# EAGLE design LED_Display_4dig (EAGLE 6.4)
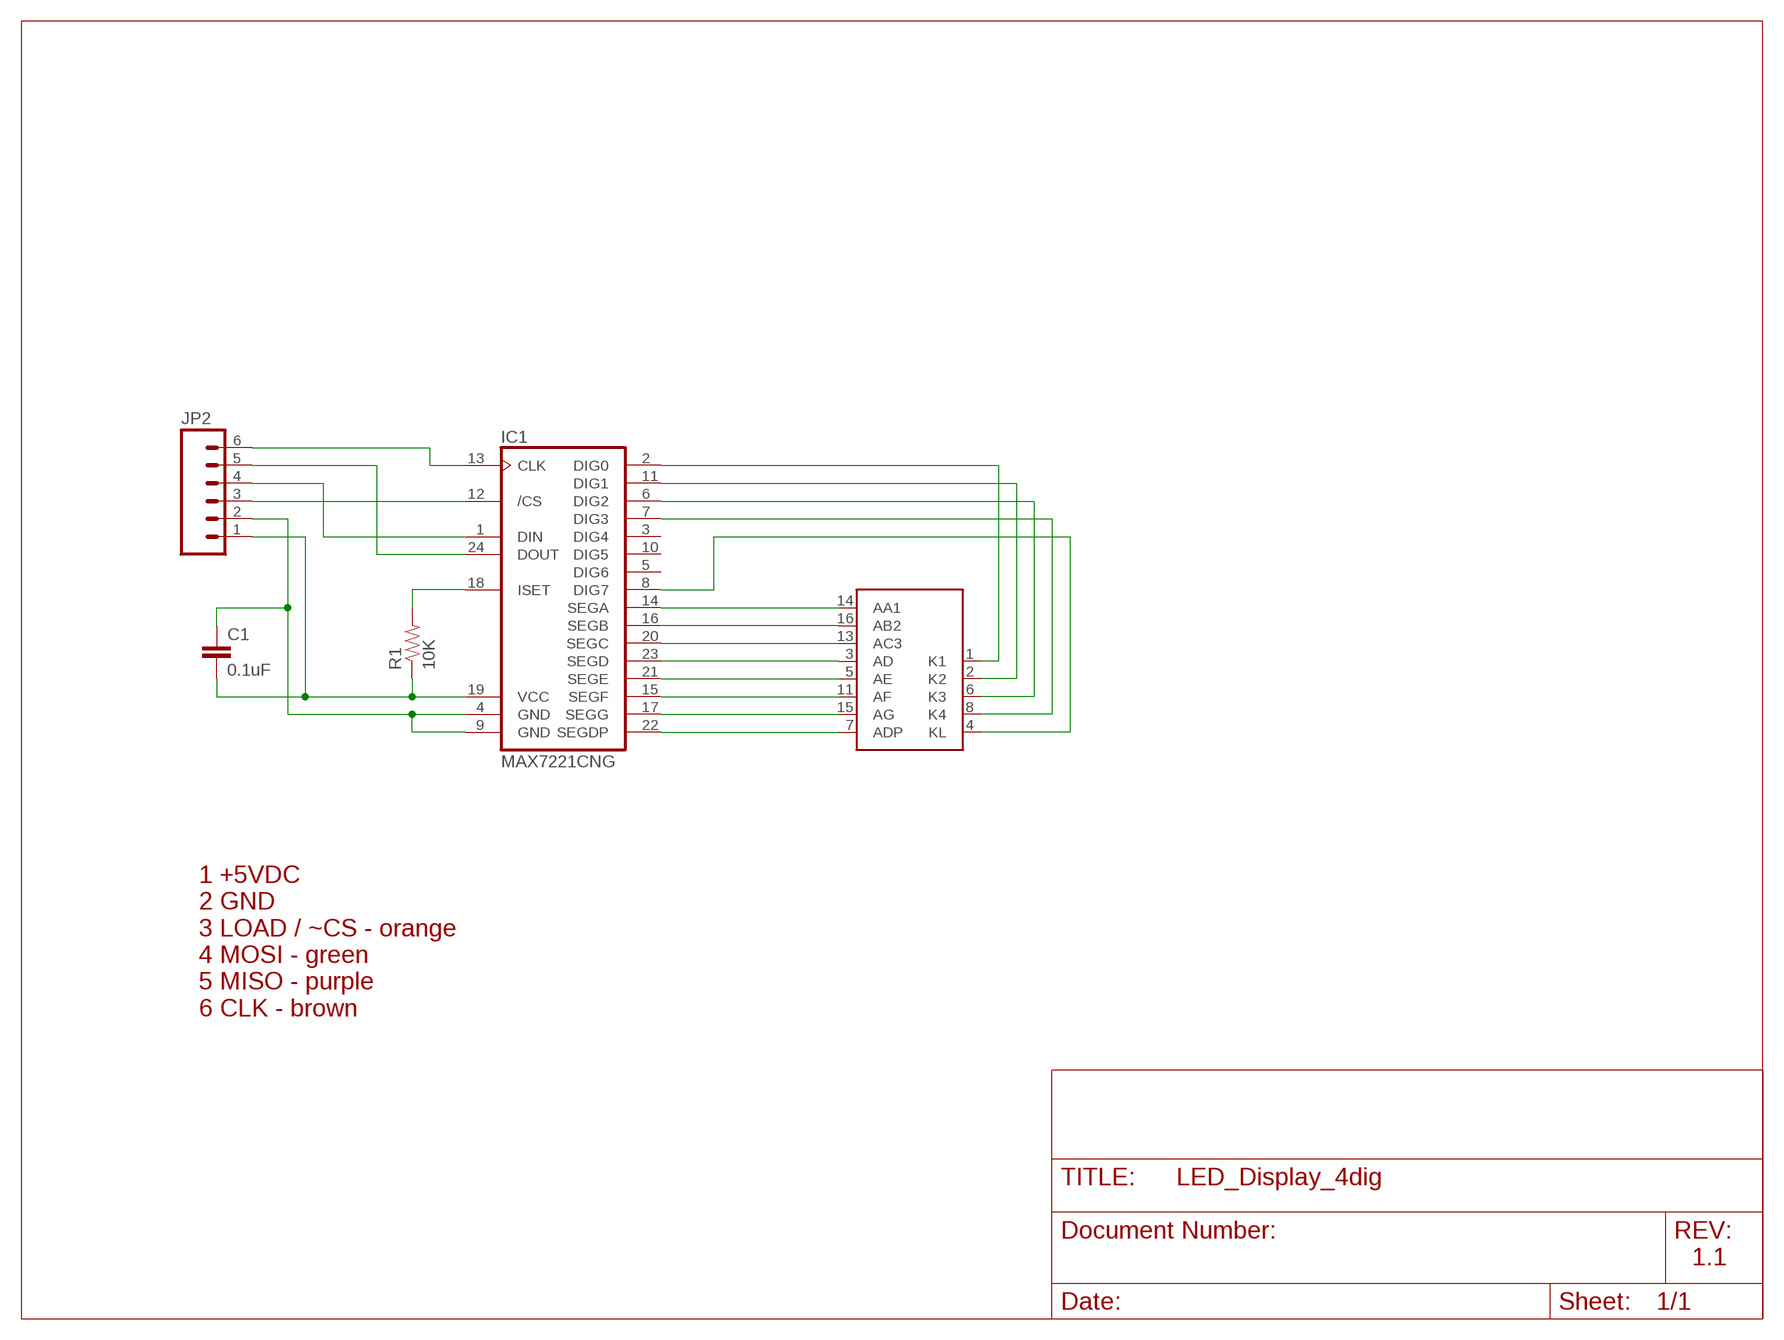
[diagram p0: schematic, sheet 1]

## Parts
C1  0.1uF  CAPPTH  [CAP-PTH-SMALL]
IC1  MAX7221CNG  [DIL24-3]
JP2  M06LOCK_LONGPADS  [1X06_LOCK_LONGPADS]
R1  10K  RESISTORPTH-1/4W  [AXIAL-0.4]
U$1  LTC-4027JRLTC-4027JR  [LTC-4727JR]

## Nets
+5VDC [POWER]: C1.2 IC1.19(VCC) JP2.1 R1.P$1
GND [POWER]: C1.1 IC1.4(GND) IC1.9(GND) JP2.2
N$4: IC1.12(/CS) JP2.3
N$5: IC1.1(DIN) JP2.4
N$6: IC1.24(DOUT) JP2.5
N$7: IC1.13(CLK) JP2.6
N$8: IC1.2(DIG0) U$1.1(K1)
N$9: IC1.11(DIG1) U$1.2(K2)
N$10: IC1.6(DIG2) U$1.6(K3)
N$11: IC1.7(DIG3) U$1.8(K4)
N$12: IC1.8(DIG7) U$1.4(KL)
N$13: IC1.14(SEGA) U$1.14(AA1)
N$14: IC1.16(SEGB) U$1.16(AB2)
N$15: IC1.20(SEGC) U$1.13(AC3)
N$16: IC1.23(SEGD) U$1.3(AD)
N$17: IC1.21(SEGE) U$1.5(AE)
N$18: IC1.15(SEGF) U$1.11(AF)
N$19: IC1.17(SEGG) U$1.15(AG)
N$20: IC1.22(SEGDP) U$1.7(ADP)
N$21: IC1.18(ISET) R1.P$2
Unconnected: IC1.3(DIG4) IC1.5(DIG6) IC1.10(DIG5)

## Notes on the sheet
- 1 +5VDC
  2 GND
  3 LOAD / ~CS - orange
  4 MOSI - green
  5 MISO - purple
  6 CLK - brown
- 1.1

## Library data of the parts
C1 = SparkFun-Capacitors:CAP: Capacitor Standard 0603 ceramic capacitor, and 0.1" leaded capacitor.
IC1 = maxim-6a:MAX7221*: Serially Interfaced, 8-Digit LED Display Drivers
JP2 = SparkFun-Connectors:M06: Header 6 Standard 6-pin 0.1" header. Use with straight break away headers (SKU : PRT-00116), right angle break away headers (PRT-00553), swiss pins (PRT-00743), machine pins (PRT-00117), and female headers (PRT-00115). Molex polarized connector foot print use with SKU : PRT-08094 with associated crimp pins and housings. NOTES ON THE VARIANTS LOCK and LOCK_LONGPADS... This footprint was designed to help hold the alignment of a through-hole component (i.e. 6-pin header) while soldering it into place. You may notice that each hole has been shifted either up or down by 0.005 of an inch from it's more standard position (which is a perfectly straight line). This slight alteration caused the pins (the squares in the middle) to touch the edges of the holes. Because they are alternating, it causes a "brace" to hold the component in place. 0.005 has proven to be the perfect amount of "off-center" position when using our standard breakaway headers. Although looks a little odd when you look at the bare footprint, once you have a header in there, the alteration is very hard to notice. Also, if you push a header all the way into place, it is covered up entirely on the bottom side. This idea of altering the position of holes to aid alignment will be further integrated into the Sparkfun Library for other footprints. It can help hold any component with 3 or more connection pins.
R1 = SparkFun-Passives:RESISTOR: Resistor Basic schematic elements and footprints for 0603, 1206, and PTH resistors.
U$1 = LTC-4727JR:LTC-4027JR

## Net classes
1 POWER: width 0.61 mm

## Board
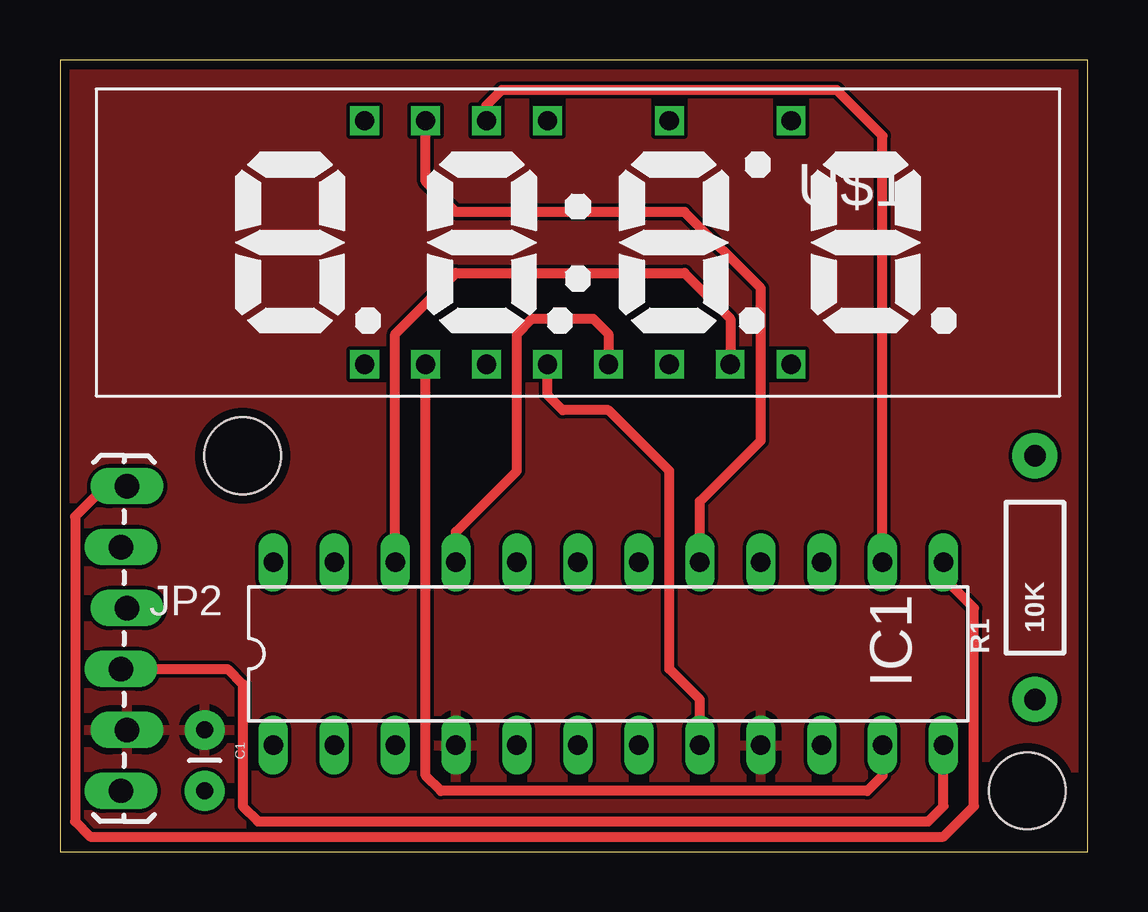
[diagram p1: board, top side]
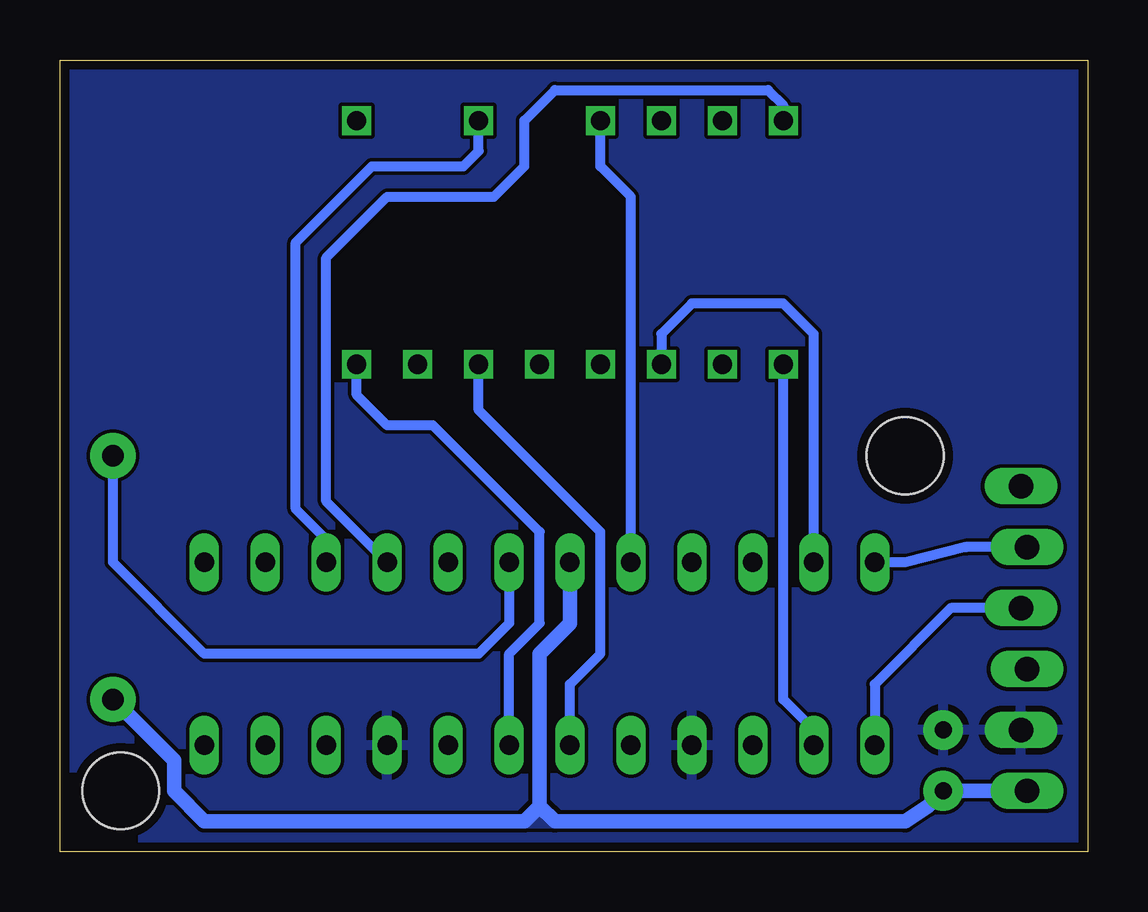
[diagram p2: board, bottom side, seen from below]

Size 42.85 x 33.01 mm. Coordinates in mm from the lower left corner, seen from the top.
Outline: 0,0 42.85,0 42.85,33.01 0,33.01 0,0
Copper layers (1*16): Top 0.0356mm / dielectric 1.5011mm / Bottom 0.0356mm
Design rules "LaenPCBOrder": minimum track width 6mil, minimum drill 13mil, track to track 6mil, track to pad 6mil, pad to pad 6mil, via to via 6mil, smd to smd 6mil, copper to edge 15mil, drill to drill 6mil, minimum pad ring 7mil, minimum via ring 7mil, stop-mask expansion 4mil, vias tented up to drill 0mil, thermal gap 10mil
Holes 3.2 mm at 7.62,16.51 40.32,2.54

### Footprints (pad centres in the part's own frame; a part is rotated, then mirrored left to right if it is on the bottom)
CAP-PTH-SMALL = drill 0.7 pad 1.651: 1 0,0; 2 2.54,0
DIL24-3 = drill 0.813 long: 1 -13.97,-3.81; 2 -11.43,-3.81; 3 -8.89,-3.81; 4 -6.35,-3.81; 5 -3.81,-3.81; 6 -1.27,-3.81; 7 1.27,-3.81; 8 3.81,-3.81; 9 6.35,-3.81; 10 8.89,-3.81; 11 11.43,-3.81; 12 13.97,-3.81; 13 13.97,3.81; 14 11.43,3.81; 15 8.89,3.81; 16 6.35,3.81; 17 3.81,3.81; 18 1.27,3.81; 19 -1.27,3.81; 20 -3.81,3.81; 21 -6.35,3.81; 22 -8.89,3.81; 23 -11.43,3.81; 24 -13.97,3.81
1X06_LOCK_LONGPADS = drill 1.016 long: 1 0,0; 2 2.54,-0.254; 3 5.08,0; 4 7.62,-0.254; 5 10.16,0; 6 12.7,-0.254
AXIAL-0.4 = drill 0.9 pad 1.88: P$1 -5.08,0; P$2 5.08,0
LTC-4727JR = drill 0.8 square: 1 -8.89,-5.08; 2 -6.35,-5.08; 3 -3.81,-5.08; 4 -1.27,-5.08; 5 1.27,-5.08; 6 3.81,-5.08; 7 6.35,-5.08; 8 8.89,-5.08; 9 8.89,5.08; 11 3.81,5.08; 13 -1.27,5.08; 14 -3.81,5.08; 15 -6.35,5.08; 16 -8.89,5.08

### Placement (x,y rotation side)
C1  6.03,5.08 270 top
IC1  22.86,8.26 0 top
JP2  2.54,2.54 90 top
R1  40.64,11.43 90 top
U$1  21.59,25.4 0 top

### Tracks (layer width: path | path; a pad name or v marks a point on that pad's centre or on a via)
+5VDC
  Bottom 0.61: JP2.1 C1.2 6.67,1.91 7.62,1.27 22.23,1.27 22.86,1.91 | 22.86,1.91 22.86,8.26 21.59,9.53 IC1.19 | R1.P$1 38.1,3.81 38.1,2.54 36.83,1.27 23.5,1.27 22.86,1.91
  pour Bottom: 22.86,1.91 22.23,1.27 23.5,1.27
GND
  pour Bottom (rank 3): 0,0 0,33.02 43.18,33.02 43.18,0
  pour Top: 0,0 0,33.02 43.18,33.02 43.18,0
N$4
  Top 0.406: JP2.3 6.99,7.62 7.62,6.99 7.62,1.91 8.26,1.27 36.2,1.27 36.83,1.91 IC1.12
N$5
  Bottom 0.406: JP2.4 5.71,10.16 8.89,6.99 IC1.1
N$6
  Bottom 0.406: JP2.5 5.08,12.7 7.62,12.06 IC1.24
N$7
  Top 0.406: JP2.6 1.91,15.24 0.64,13.97 0.64,1.27 1.27,0.64 36.83,0.64 38.1,1.91 38.1,10.16 36.83,11.43 IC1.13
N$8
  Bottom 0.406: IC1.2 11.43,5.08 12.7,6.35 U$1.1
N$9
  Top 0.406: IC1.11 34.29,3.17 33.66,2.54 15.88,2.54 15.24,3.17 U$1.2
N$10
  Bottom 0.406: IC1.6 21.59,6.99 20.32,8.26 20.32,13.34 25.4,18.41 U$1.6
N$11
  Bottom 0.406: IC1.7 24.13,8.26 22.86,9.53 22.86,13.34 27.3,17.78 29.21,17.78 30.48,19.05 U$1.8
N$12
  Top 0.406: IC1.8 26.67,6.35 25.4,7.62 25.4,15.88 22.86,18.41 20.95,18.41 20.32,19.05 U$1.4
N$13
  Top 0.406: IC1.14 34.29,29.84 32.38,31.75 18.41,31.75 17.78,31.11 U$1.14
N$14
  Bottom 0.406: IC1.16 31.75,14.61 31.75,24.77 29.21,27.3 24.77,27.3 23.5,28.57 23.5,30.48 22.23,31.75 13.34,31.75 12.7,31.11 U$1.16
N$15
  Bottom 0.406: IC1.20 19.05,27.3 20.32,28.57 U$1.13
N$16
  Bottom 0.406: IC1.23 11.43,21.59 12.7,22.86 16.51,22.86 17.78,21.59 U$1.3
N$17
  Top 0.406: IC1.21 16.51,13.34 19.05,15.88 19.05,21.59 19.68,22.23 22.23,22.23 22.86,21.59 U$1.5
N$18
  Bottom 0.406: IC1.15 31.75,13.02 33.02,14.29 33.02,25.4 29.84,28.57 26.04,28.57 25.4,29.21 U$1.11
N$19
  Top 0.406: U$1.15 15.24,27.94 16.51,26.67 26.04,26.67 29.21,23.5 29.21,17.14 26.67,14.61 IC1.17
N$20
  Top 0.406: IC1.22 13.97,21.59 16.51,24.13 26.04,24.13 27.94,22.23 U$1.7
N$21
  Bottom 0.406: IC1.18 24.13,9.53 25.4,8.26 36.83,8.26 40.64,12.06 R1.P$2

### Text on the board
tValues: LED_Display_4dig v1.1 | CLK | cbm Electronics 2013 | MOSI | MISO | ~CS | GND | +5V